# EAGLE design decoder (EAGLE 7.2.0)
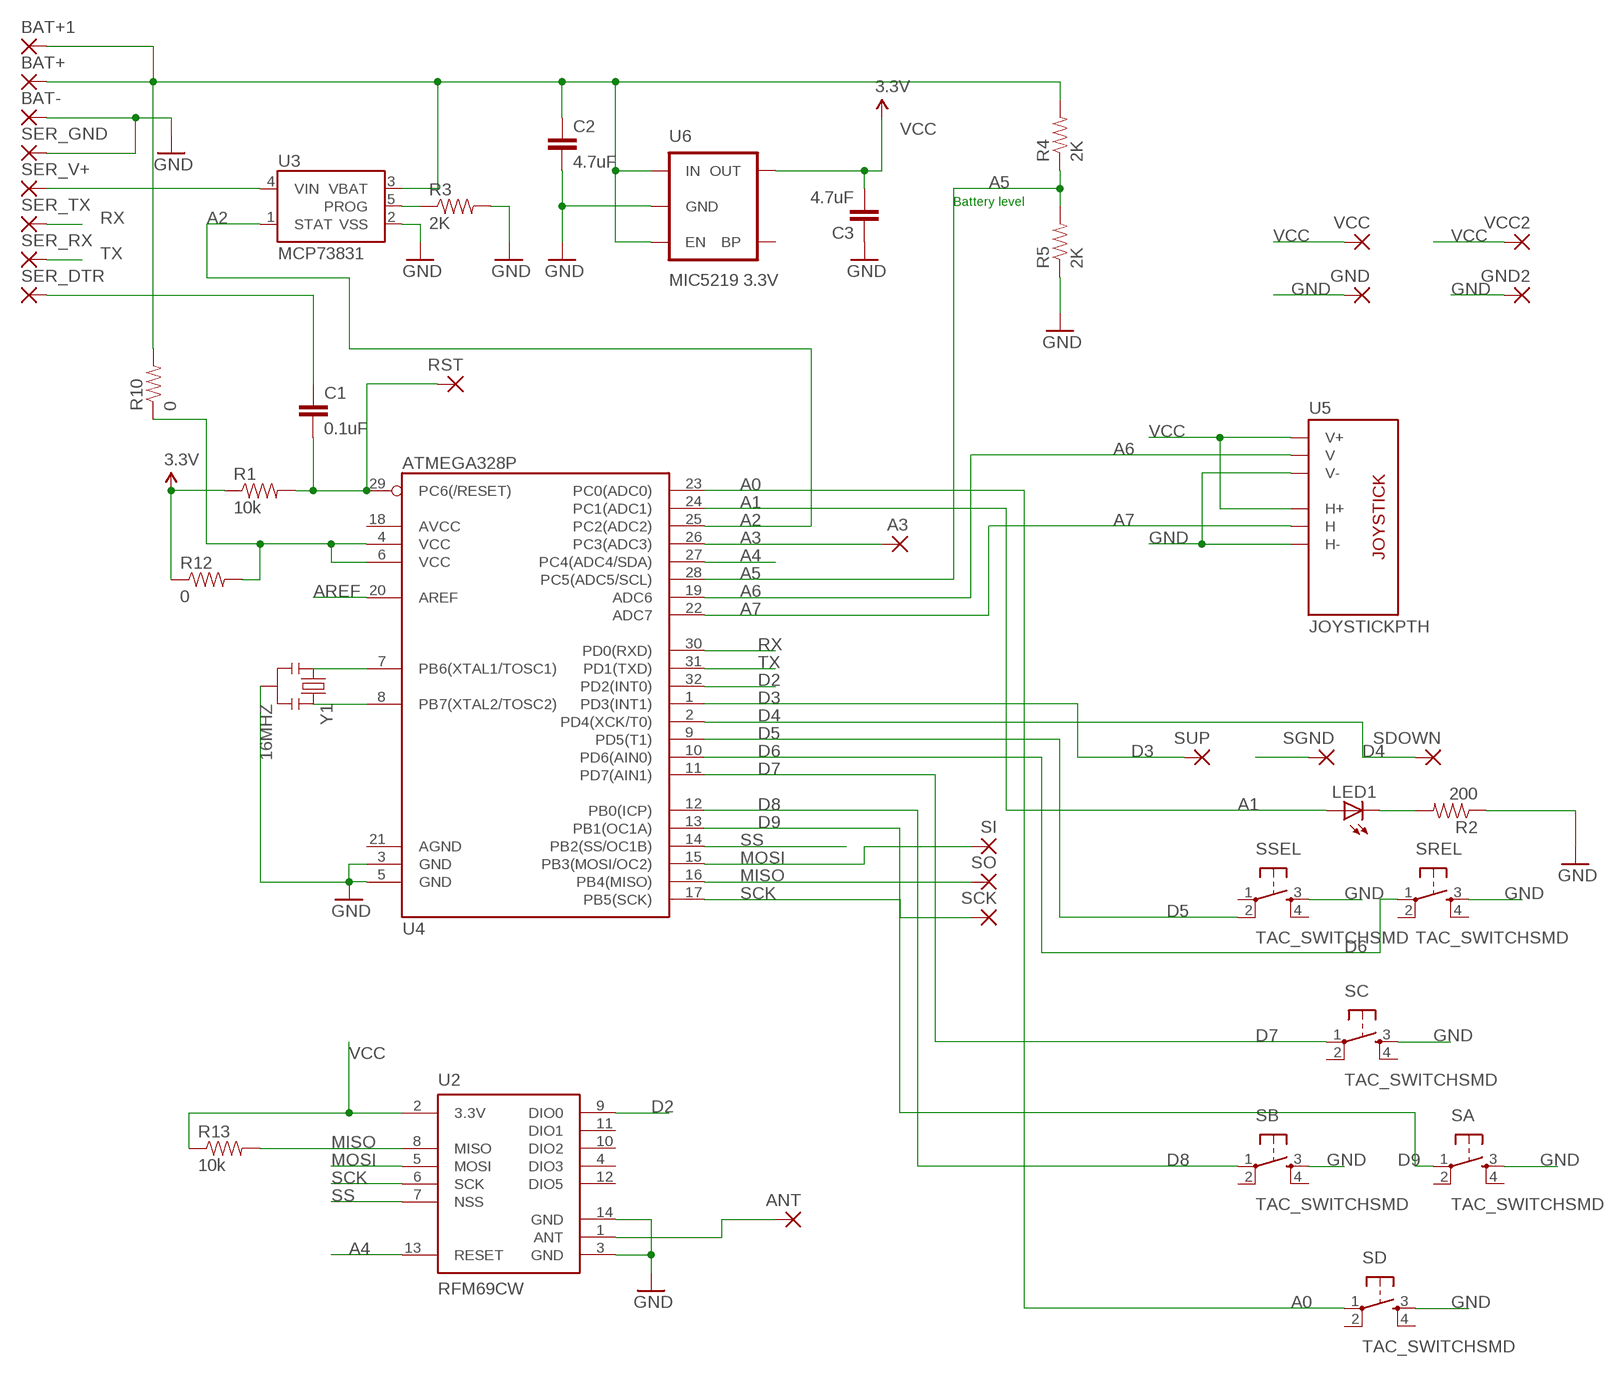
[diagram p0: schematic, sheet 1]

## Parts
A3  SMD2  [SMD1,27-2,54]
ANT  SMD2  [SMD1,27-2,54]
BAT+  SMD2  [SMD1,27-2,54]
BAT+1  SMD2  [SMD1,27-2,54]
BAT-  SMD2  [SMD1,27-2,54]
C1  0.1uF  CAP0805  [0805]
C2  4.7uF  CAP0805  [0805]
C3  4.7uF  CAP0805  [0805]
GND  SMD2  [SMD1,27-2,54]
GND2  SMD2  [SMD1,27-2,54]
LED1  LED3MM  [LED3MM]
R1  10k  RESISTOR0603-RES  [0603-RES]
R2  200  RESISTOR0603-RES  [0603-RES]
R3  2K  RESISTOR0603-RES  [0603-RES]
R4  2K  RESISTOR0603-RES  [0603-RES]
R5  2K  RESISTOR0603-RES  [0603-RES]
R10  0  RESISTOR0603-RES  [0603-RES]
R12  0  RESISTOR0603-RES  [0603-RES]
R13  10k  RESISTOR0603-RES  [0603-RES]
RST  SMD2  [SMD1,27-2,54]
SA  TAC_SWITCHSMD  [TACTILE-SWITCH-SMD]
SB  TAC_SWITCHSMD  [TACTILE-SWITCH-SMD]
SC  TAC_SWITCHSMD  [TACTILE-SWITCH-SMD]
SCK  SMD2  [SMD1,27-2,54]
SD  TAC_SWITCHSMD  [TACTILE-SWITCH-SMD]
SDOWN  SMD2  [SMD1,27-2,54]
SER_DTR  SMD2  [SMD1,27-2,54]
SER_GND  SMD2  [SMD1,27-2,54]
SER_RX  SMD2  [SMD1,27-2,54]
SER_TX  SMD2  [SMD1,27-2,54]
SER_V+  SMD2  [SMD1,27-2,54]
SGND  SMD2  [SMD1,27-2,54]
SI  SMD2  [SMD1,27-2,54]
SO  SMD2  [SMD1,27-2,54]
SREL  TAC_SWITCHSMD  [TACTILE-SWITCH-SMD]
SSEL  TAC_SWITCHSMD  [TACTILE-SWITCH-SMD]
SUP  SMD2  [SMD1,27-2,54]
U2  RFM69CW  [RFM69CW-XXXS2]
U3  MCP73831  [SOT23-5]
U4  ATMEGA328P  ATMEGA328_SMT  [TQFP32-08]
U5  JOYSTICKPTH  [JOYSTICK]
U6  MIC5219 3.3V  V_REG_MIC52193.3V  [SOT23-5]
VCC  SMD2  [SMD1,27-2,54]
VCC2  SMD2  [SMD1,27-2,54]
Y1  16MHZ  RESONATOR16MHZ  [RESONATOR-SMD]

## Nets
A0: SD.1 U4.23(PC0(ADC0))
A1: LED1.A U4.24(PC1(ADC1))
A2: U3.1(STAT) U4.25(PC2(ADC2))
A3: A3.1(P) U4.26(PC3(ADC3))
A4: U2.13(RESET) U4.27(PC4(ADC4/SDA))
A5: R4.1 R5.2 U4.28(PC5(ADC5/SCL))
A6: U4.19(ADC6) U5.V2(V)
A7: U4.22(ADC7) U5.H2(H)
AREF: U4.20(AREF)
BAT+: BAT+1.1(P) BAT+.1(P) C2.1 R4.2 R10.2 U3.3(VBAT) U6.1(IN) U6.3(EN)
D2: U2.9(DIO0) U4.32(PD2(INT0))
D3: SUP.1(P) U4.1(PD3(INT1))
D4: SDOWN.1(P) U4.2(PD4(XCK/T0))
D5: SSEL.2 U4.9(PD5(T1))
D6: SREL.1 U4.10(PD6(AIN0))
D7: SC.1 U4.11(PD7(AIN1))
D8: SB.1 U4.12(PB0(ICP))
D9: SA.1 U4.13(PB1(OC1A))
GND: BAT-.1(P) C2.2 C3.1 GND2.1(P) GND.1(P) R2.1 R3.2 R5.1 SA.3 SB.3 SC.3 SD.3 SER_GND.1(P) SGND.1(P) SREL.3 SSEL.3 U2.3(GND) U2.14(GND) U3.2(VSS) U4.3(GND) U4.5(GND) U5.H3(H-) U5.V3(V-) U6.2(GND) Y1.2
MISO: R13.2 SO.1(P) U2.8(MISO) U4.16(PB4(MISO))
MOSI: SI.1(P) U2.5(MOSI) U4.15(PB3(MOSI/OC2))
N$1: ANT.1(P) U2.1(ANT)
N$2: U4.7(PB6(XTAL1/TOSC1)) Y1.1
N$3: C1.1 SER_DTR.1(P)
N$4: U4.8(PB7(XTAL2/TOSC2)) Y1.3
N$5: C1.2 R1.2 RST.1(P) U4.29(PC6(/RESET))
N$8: R10.1 R12.2 U4.4(VCC) U4.6(VCC)
N$9: SER_V+.1(P) U3.4(VIN)
N$11: R3.1 U3.5(PROG)
N$17: LED1.K(C) R2.2
RX: SER_TX.1(P) U4.30(PD0(RXD))
SCK: SCK.1(P) U2.6(SCK) U4.17(PB5(SCK))
SS: U2.7(NSS) U4.14(PB2(SS/OC1B))
TX: SER_RX.1(P) U4.31(PD1(TXD))
VCC: C3.2 R1.1 R12.1 R13.1 U2.2(3.3V) U5.H1(H+) U5.V1(V+) U6.5(OUT) VCC2.1(P) VCC.1(P) ; supply symbol labelled 3.3V
Unconnected: SA.2 SA.4 SB.2 SB.4 SC.2 SC.4 SD.2 SD.4 SREL.2 SREL.4 SSEL.1 SSEL.4 U2.4(DIO3) U2.10(DIO2) U2.11(DIO1) U2.12(DIO5) U4.18(AVCC) U4.21(AGND) U6.4(BP)

## Notes on the sheet
- Battery level

## Library data of the parts
A3 ANT BAT+ BAT+1 BAT- GND GND2 RST SCK SDOWN SER_DTR SER_GND SER_RX SER_TX SER_V+ SGND SI SO SUP VCC VCC2 = wirepad:SMD2: SMD PAD
C1-C3 = SparkFun-Capacitors:CAP: Capacitor Standard 0603 ceramic capacitor, and 0.1" leaded capacitor.
LED1 = led:LED: LED OSRAM: - CHIPLED LG R971, LG N971, LY N971, LG Q971, LY Q971, LO R971, LY R971 LH N974, LH R974 LS Q976, LO Q976, LY Q976 LO Q996 - Hyper CHIPLED LW Q18S LB Q993, LB Q99A, LB R99A - SideLED LS A670, LO A670, LY A670, LG A670, LP A670 LB A673, LV A673, LT A673, LW A673 LH A674 LY A675 LS A676, LA A676, LO A676, LY A676, LW A676 LS A679, LY A679, LG A679 - Hyper Micro SIDELED® LS Y876, LA Y876, LO Y876, LY Y876 LT Y87S - SmartLED LW L88C, LW L88S LB L89C, LB L89S, LG L890 LS L89K, LO L89K, LY L89K LS L896, LA L896, LO L896, LY L896 - TOPLED LS T670, LO T670, LY T670, LG T670, LP T670 LSG T670, LSP T670, LSY T670, LOP T670, LYG T670 LG T671, LOG T671, LSG T671 LB T673, LV T673, LT T673, LW T673 LH T674 LS T676, LA T676, LO T676, LY T676, LB T676, LH T676, LSB T676, LW T676 LB T67C, LV T67C, LT T67C, LS T67K, LO T67K, LY T67K, LW E67C LS E67B, LA E67B, LO E67B, LY E67B, LB E67C, LV E67C, LT E67C LW T67C LS T679, LY T679, LG T679 LS T770, LO T770, LY T770, LG T770, LP T770 LB T773, LV T773, LT T773, LW T773 LH T774 LS E675, LA E675, LY E675, LS T675 LS T776, LA T776, LO T776, LY T776, LB T776 LHGB T686 LT T68C, LB T68C - Hyper Mini TOPLED® LB M676 - Mini TOPLED Santana® LG M470 LS M47K, LO M47K, LY M47K Source: http://www.osram.convergy.de LUXEON: - LUMILED® LXK2-PW12-R00, LXK2-PW12-S00, LXK2-PW14-U00, LXK2-PW14-V00 LXK2-PM12-R00, LXK2-PM12-S00, LXK2-PM14-U00 LXK2-PE12-Q00, LXK2-PE12-R00, LXK2-PE12-S00, LXK2-PE14-T00, LXK2-PE14-U00 LXK2-PB12-K00, LXK2-PB12-L00, LXK2-PB12-M00, LXK2-PB14-N00, LXK2-PB14-P00, LXK2-PB14-Q00 LXK2-PR12-L00, LXK2-PR12-M00, LXK2-PR14-Q00, LXK2-PR14-R00 LXK2-PD12-Q00, LXK2-PD12-R00, LXK2-PD12-S00 LXK2-PH12-R00, LXK2-PH12-S00 LXK2-PL12-P00, LXK2-PL12-Q00, LXK2-PL12-R00 Source: www.luxeon.com KINGBRIGHT: KA-3528ASYC Source: www.kingbright.com
R1-R5 R10 R12 R13 = SparkFun-Resistors:RESISTOR: Resistor Basic schematic elements and footprints for 0603, 1206, and PTH resistors.
SA SB SC SD SREL SSEL = SparkFun-Retired:TAC_SWITCH: Momentary Switch Button commonly used for reset or general input. Spark Fun Electronics SKU : COM-00097 SMT- SWCH-08247; PROD_ID: SWCH-08247
U2 = SparkFun-RF:RFM69
U3 = SparkFun-PowerIC:MCP73831: Miniature single cell, fully integrated Li-Ion, Li-polymer charge management controller http://ww1.microchip.com/downloads/en/DeviceDoc/21984a.pdf IC-09995; PROD_ID: IC-09995
U4 = SparkFun-DigitalIC:ATMEGA328_SMT: 32-Pin Atmega328 part Commonly used on Arduino compatible boards Available in QFP and QFN packages TQFP is IC-09069 QFN is non-stock; PROD_ID: IC-09069
U5 = Arduino_merg:JOYSTICK: Thumb Joystick Joystick commonly found in PS2 controllers. Two pots and a select switch. Adapted from Sparkfun Library (but for more common 6mm switch sticks)
U6 = SparkFun-PowerIC:V_REG_MIC5219: V_REG MIC5219 Standard 3.3V and 5V 500mA LDO voltage regulator in SOT-23 layout. Micrel part MIC5219. BP (by-pass) pin is used to lower output noise with 470pF cap, may be left open.; PROD_ID: VREG-09872
Y1 = SparkFun-FreqCtrl:RESONATOR: Resonator Small SMD resonator. Used, eg, on the Arduino Pro/ Pro Mini boards. 8MHz- XTAL-08895 16MHz- XTAL-08900; PROD_ID: XTAL-08900

## Board
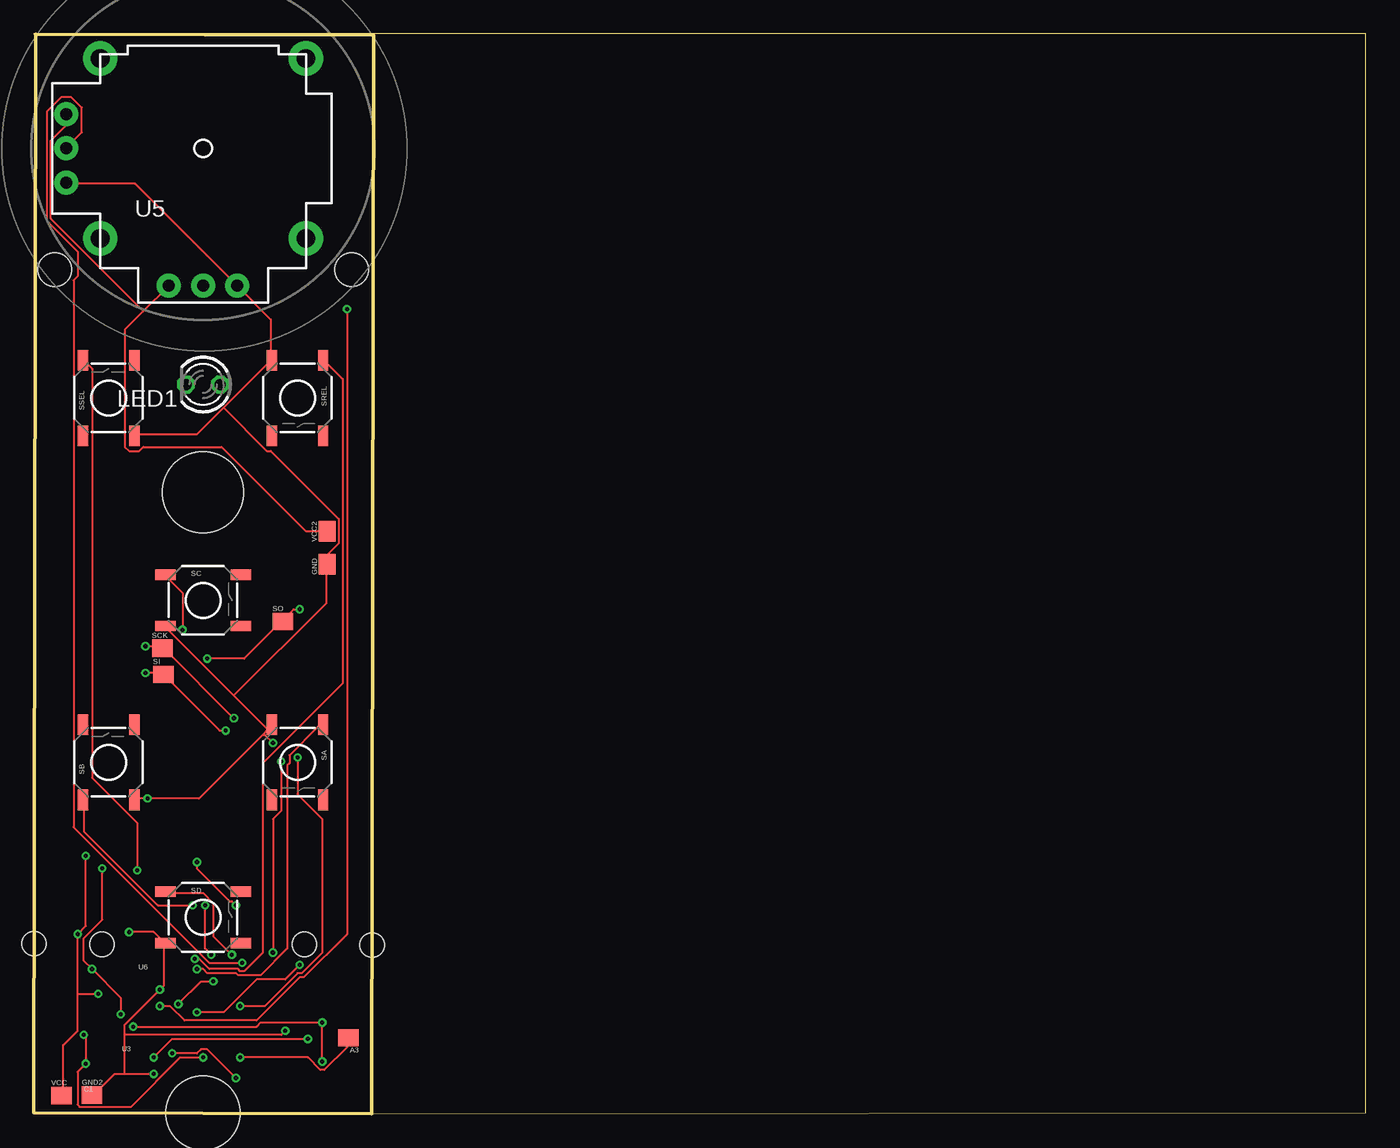
[diagram p1: board, top side]
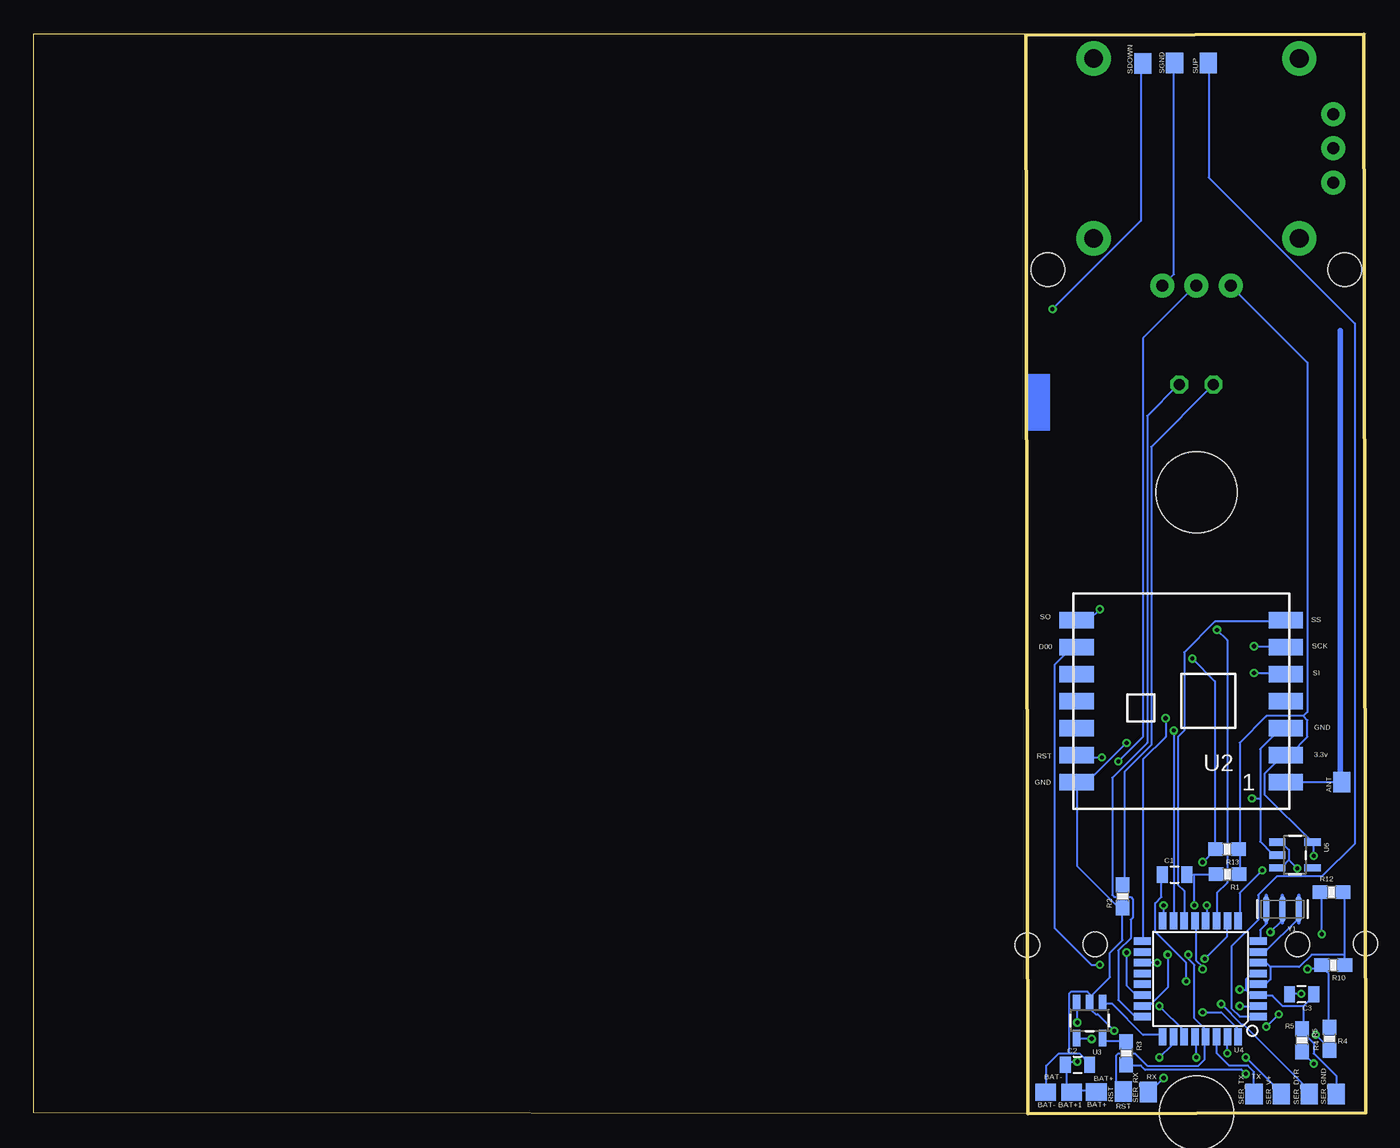
[diagram p2: board, bottom side, seen from below]

Size 98.73 x 80.06 mm. Coordinates in mm from the lower left corner, seen from the top.
Outline: 25.05,0 98.73,0.06 98.73,80.06 0,80.06 0.15,80.01
Outline: 0.15,80.01 25.2,79.95 25.05,0
Outline: 25.05,0 0,0.06 0.15,80.01
Copper layers (1*16): Top 0.035mm / dielectric 1.5mm / Bottom 0.035mm
Design rules "Elecrow_2-layer_eagle_rule": minimum track width 6mil, minimum drill 12mil, track to track 6mil, track to pad 6mil, pad to pad 6mil, via to via 6mil, smd to smd 0mil, copper to edge 10mil, drill to drill 10mil, minimum pad ring 10mil, minimum via ring 6mil, stop-mask expansion 2mil, vias tented up to drill 100mil, thermal gap 10mil
Holes 1.8 mm at 20.05,12.56 5.05,12.56 25.08,12.51 0.03,12.61
Holes 6 mm at 12.55,46.06
Holes 2.5 mm at 23.55,62.56 1.55,62.56
Holes 5.5 mm at 12.55,0.06

### Footprints (pad centres in the part's own frame; a part is rotated, then mirrored left to right if it is on the bottom)
SMD1,27-2,54 = smd 1.27 x 1.524: 1 0,0
0805 = smd 0.8 x 1.2: 1 -0.9,0; 2 0.9,0
LED3MM = drill 0.813 octagon: A -1.27,0; K 1.27,0
0603-RES = smd 1.1 x 1: 1 -0.85,0; 2 0.85,0
TACTILE-SWITCH-SMD = smd 1.524 x 0.762: 1 -2.794,1.905; 2 2.794,1.905; 3 -2.794,-1.905; 4 2.794,-1.905
RFM69CW-XXXS2 = smd 2.543 x 1.2: 1 -7.754,6; 2 -7.754,4; 3 -7.754,2; 4 -7.754,0; 5 -7.754,-2; 6 -7.754,-4; 7 -7.754,-6; 8 7.754,-6; 9 7.754,-4; 10 7.754,-2; 11 7.754,0; 12 7.754,2; 13 7.754,4; 14 7.754,6
SOT23-5 = smd 0.55 x 1.2: 1 -0.95,-1.3; 2 0,-1.3; 3 0.95,-1.3; 4 0.95,1.3; 5 -0.95,1.3
TQFP32-08 = smd 1.27 x 0.559: 1 -4.293,2.8; 2 -4.293,2; 3 -4.293,1.2; 4 -4.293,0.4; 5 -4.293,-0.4; 6 -4.293,-1.2; 7 -4.293,-2; 8 -4.293,-2.8; 17 4.293,-2.8; 18 4.293,-2; 19 4.293,-1.2; 20 4.293,-0.4; 21 4.293,0.4; 22 4.293,1.2; 23 4.293,2; 24 4.293,2.8 | smd 0.559 x 1.27: 9 -2.8,-4.293; 10 -2,-4.293; 11 -1.2,-4.293; 12 -0.4,-4.293; 13 0.4,-4.293; 14 1.2,-4.293; 15 2,-4.293; 16 2.8,-4.293; 25 2.8,4.293; 26 2,4.293; 27 1.2,4.293; 28 0.4,4.293; 29 -0.4,4.293; 30 -1.2,4.293; 31 -2,4.293; 32 -2.8,4.293
JOYSTICK = drill 0.889 pad 1.778: H1 -2.54,-10.16; H2 0,-10.16; H3 2.54,-10.16; V1 -10.16,2.54; V2 -10.16,0; V3 -10.16,-2.54 | drill 1.397 pad 2.54: MOUNT1 -7.62,6.668; MOUNT2 -7.62,-6.668; MOUNT3 7.62,-6.668; MOUNT4 7.62,6.668
RESONATOR-SMD = smd 0.45 x 1.905: 1 -1.2,0; 2 0,0; 3 1.2,0

### Placement (x,y rotation side)
A3  23.33,5.65 90 top
ANT  1.79,24.6 0 bottom
BAT+  19.97,1.61 90 bottom
BAT+1  21.81,1.59 90 bottom
BAT-  23.74,1.58 90 bottom
C1  14.17,17.73 0 bottom
C2  21.37,3.63 0 bottom
C3  4.75,8.85 180 bottom
GND  21.76,40.73 0 top
GND2  4.33,1.39 270 top
LED1  12.55,54.06 180 top
R1  10.24,17.75 180 bottom
R2  18.03,16.12 90 bottom
R3  17.75,4.49 270 bottom
R4  2.69,5.57 90 bottom
R5  4.72,5.45 270 bottom
R10  2.41,11.03 180 bottom
R12  2.54,16.43 0 bottom
R13  10.28,19.61 180 bottom
RST  17.96,1.64 0 bottom
SA  19.55,26.06 270 top
SB  5.55,26.06 90 top
SC  12.55,38.06 0 top
SCK  9.53,34.51 270 top
SD  12.55,14.56 0 top
SDOWN  16.53,77.87 0 bottom
SER_DTR  4.2,1.45 0 bottom
SER_GND  2.18,1.48 0 bottom
SER_RX  16.12,1.6 0 bottom
SER_TX  8.28,1.48 0 bottom
SER_V+  6.25,1.47 0 bottom
SGND  14.17,77.89 0 bottom
SI  9.61,32.58 270 top
SO  18.47,36.5 270 top
SREL  19.55,53.06 270 top
SSEL  5.55,53.06 90 top
SUP  11.68,77.88 0 bottom
U2  13.69,30.59 180 bottom
U3  20.47,6.92 180 bottom
U4  12.26,10 180 bottom
U5  12.55,71.56 0 top
U6  5.25,19.18 270 bottom
VCC  2.06,1.36 270 top
VCC2  21.74,43.17 0 top
Y1  6.18,15.17 180 bottom

### Tracks (layer width: path | path; a pad name or v marks a point on that pad's centre or on a via)
A0  (via drill 0.3)
  Top 0.152: v14.68,11.8 13.31,13.17 13.31,15.61 12.55,16.37 9.81,16.37 SD.1
  Bottom 0.152: v14.68,11.8 14.68,9.36 15.9,8.14 16.51,8.14 U4.23
A1
  Bottom 0.152: U4.24 16.66,7.22 17.12,7.22 18.34,8.44 18.34,12.1 17.43,13.01 17.43,14.39 17.27,14.54 17.27,15.91 17.43,16.06 18.65,16.06 18.8,16.21 18.8,24.9 16.21,27.49 16.21,51.72 13.92,54.01 LED1.A
A2
  Bottom 0.152: U3.1 19.41,8.14 18.8,8.14 16.51,5.85 15.14,5.85 U4.25
A3  (via drill 0.3)
  Top 0.152: v15.29,4.18 20.32,4.18 21.24,3.26 21.54,3.26 23.22,4.94 23.22,5.55 A3.1
  Bottom 0.152: v15.29,4.18 14.38,5.09 14.38,5.7 U4.26
A4  (via drill 0.3)
  Top 0.152: v15.29,7.99 17.12,7.99 19.56,10.42 19.86,10.42 21.39,11.95 21.39,21.85 19.56,23.68 v19.56,26.43
  Bottom 0.152: v15.29,7.99 13.46,6.16 13.46,5.85 U4.27 | v19.56,26.43 21.24,26.43 21.39,26.58 U2.13
A5  (via drill 0.3)
  Top 0.152: v3.71,5.85 3.86,5.7 v3.86,3.72 3.25,3.11 3.25,0.67 3.41,0.52 7.22,0.52 10.87,4.18 v12.55,4.18
  Bottom 0.152: v3.86,3.72 4.62,4.48 R5.2 | v3.71,5.85 2.64,4.78 R4.1 | v12.55,4.18 12.55,5.7 U4.28
A6  (via drill 0.3)
  Top 0.152: v15.44,11.19 13.01,11.19 2.95,21.24 2.95,61.78 3.25,62.09 3.25,63.92 0.97,66.2 0.97,74.28 2.03,75.35 2.8,75.35 3.56,74.58 3.56,72.76 2.49,71.69 U5.V2
  Bottom 0.152: v15.44,11.19 16.51,11.19 U4.19
A7  (via drill 0.3)
  Top 0.152: v17.73,11.95 17.73,21.85 18.34,22.46 v18.34,26.12
  Bottom 0.152: v17.73,11.95 17.73,9.51 17.12,8.9 16.66,8.9 U4.22 | v18.34,26.12 16.51,27.95 16.51,57.52 12.7,61.33 U5.H2
BAT+  (via drill 0.3)
  Top 0.152: v21.39,3.87 v21.39,6.77 16.82,6.77 16.51,6.46 v7.37,6.46 | v5.08,18.2 5.08,14.39 3.71,13.01 3.71,11.34 v4.32,10.73 6.45,8.59 v6.45,7.38
  Bottom 0.152: v21.39,6.77 21.39,8.14 U3.3 | v21.39,3.87 22,3.87 22.15,3.72 C2.1 22.15,3.57 22.15,2.04 21.85,1.74 BAT+1.1 21.69,1.74 20.02,1.74 BAT+.1 | 5.69,18.81 6.15,18.35 6.45,18.35 U6.3 | 5.69,18.81 5.69,19.57 6.15,20.02 6.45,20.02 U6.1 | R4.2 2.8,6.46 2.8,10.42 3.25,10.88 R10.2 3.41,10.88 3.56,10.73 v4.32,10.73 | v5.08,18.2 5.69,18.81 | v6.45,7.38 v7.37,6.46
D2  (via drill 0.3)
  Top 0.152: v12.09,7.53 14.07,7.53 16.51,9.97 18.65,9.97 v19.71,11.03
  Bottom 0.152: v12.09,7.53 10.72,7.53 9.5,6.31 9.5,5.85 U4.32 | v19.71,11.03 20.32,11.03 23.06,13.78 23.06,33.28 21.85,34.5 21.54,34.5 U2.9
D3
  Bottom 0.152: U4.1 7.98,7.22 9.35,7.22 9.96,7.83 9.96,12.4 7.98,14.39 7.98,16.21 6.61,17.59 3.25,17.59 0.81,20.02 0.81,58.58 11.63,69.4 11.63,77.78 SUP.1
D4  (via drill 0.3)
  Top 0.152: v9.35,7.99 10.11,7.99 11.18,6.92 16.51,6.92 19.71,10.12 20.02,10.12 23.22,13.32 v23.22,59.65
  Bottom 0.152: v9.35,7.99 7.98,7.99 U4.2 | v23.22,59.65 16.66,66.2 16.66,77.78 SDOWN.1
D5  (via drill 0.3)
  Top 0.152: v7.67,18.04 7.67,21.55 4.32,24.9 4.32,55.23 3.71,55.84 SSEL.2
  Bottom 0.152: v7.67,18.04 9.35,16.37 9.35,14.39 U4.9
D6  (via drill 0.3)
  Top 0.152: v11.94,11.49 12.24,11.49 13.01,10.73 15.14,10.73 15.29,10.58 15.6,10.58 16.97,11.95 16.97,25.97 22.91,31.91 22.91,54.47 21.54,55.84 SREL.1
  Bottom 0.152: v11.94,11.49 10.26,13.17 10.26,14.23 U4.10
D7  (via drill 0.3)
  Top 0.152: v11.03,35.87 11.03,38.62 9.81,39.84 SC.1
  Bottom 0.152: v11.03,35.87 10.26,35.11 10.26,17.13 11.03,16.37 11.03,14.39 U4.11
D8  (via drill 0.3)
  Top 0.152: v11.79,15.45 9.2,15.45 3.71,20.94 3.71,23.23 SB.1
  Bottom 0.152: v11.79,15.45 11.79,14.39 U4.12
D9  (via drill 0.3)
  Top 0.152: v12.09,10.73 12.55,10.73 12.85,10.42 14.99,10.42 15.14,10.27 16.82,10.27 18.8,12.25 18.8,25.82 18.95,25.97 18.95,26.58 21.08,28.71 21.39,28.71 SA.1
  Bottom 0.152: v12.09,10.73 12.09,10.88 12.55,11.34 12.55,14.23 U4.13
GND  (via drill 0.3)
  Top 0.152: 6.76,2.96 6,2.96 4.47,1.43 GND2.1 | 6.76,2.96 v8.89,2.96 | 6.76,2.96 6.76,5.85 | 6.76,5.85 6.76,6.61 v9.35,9.2 9.65,9.51 9.65,12.56 SD.3 9.65,12.71 8.89,13.47 v7.06,13.47 | 6.76,5.85 18.34,5.85 v18.65,6.16 | 17.43,28.56 17.58,28.71 SA.3 17.43,28.56 | 17.43,28.56 16.97,28.1 | 16.97,28.1 12.24,23.38 v8.43,23.38 7.52,23.38 SB.3 | 14.84,31 17.27,28.56 17.43,28.56 | 14.84,31 9.81,36.03 SC.3 | 14.84,31 21.69,37.86 21.69,40.6 GND.1 21.85,40.75 21.85,41.51 22.61,42.28 22.61,44.1 17.58,49.13 17.27,49.13 14.07,52.33 | 14.07,52.33 17.58,55.84 SREL.3 17.58,55.99 17.58,58.89 15.14,61.33 U5.H3 14.99,61.48 7.52,68.95 2.49,68.95 U5.V3 | 14.07,52.33 12.09,50.35 7.52,50.35 SSEL.3 | v17.73,27.49 17.12,28.1 16.97,28.1
  Bottom 0.152: 8.89,9.2 8.59,8.9 7.98,8.9 U4.3 7.82,8.75 6.91,8.75 6.15,7.99 4.62,7.99 | 8.89,9.2 8.89,9.97 8.59,10.27 7.98,10.27 U4.5 | 4.62,7.99 4.62,6.31 R5.1 4.78,6.16 3.86,5.24 3.86,4.48 2.19,2.8 2.19,1.58 SER_GND.1 | 4.62,7.99 3.86,8.75 C3.1 | v8.89,2.96 9.2,3.26 16.36,3.26 16.66,3.57 17.73,3.57 R3.2 | v7.06,13.47 6.3,14.23 6.18,14.15 | v9.35,9.2 8.89,9.2 | 22,4.48 22.76,4.48 23.67,3.57 23.67,1.58 BAT-.1 | 22,4.48 21.24,4.48 20.47,3.72 C2.2 | 18.04,15 18.04,12.86 18.95,11.95 18.95,10.12 20.32,8.75 | 18.04,15 18.04,15.15 R2.1 18.04,15 | 20.32,8.75 20.32,8.29 U3.2 | 18.04,15 21.39,18.35 21.39,24.44 U2.14 21.39,24.6 20.63,24.6 v17.73,27.49 | 22,4.48 22,8.9 21.85,9.05 20.63,9.05 20.32,8.75 | 20.32,8.75 U3.2 | v18.65,6.16 19.86,7.38 20.02,7.38 20.32,7.68 20.32,8.14 U3.2 | 7.82,23.38 7.82,27.04 6.3,28.56 6,28.56 U2.3 | 7.82,23.38 7.82,20.18 6.91,19.26 6.61,19.26 U6.2 | v8.43,23.38 7.82,23.38 | SGND.1 14.23,77.78 14.23,62.24 14.99,61.48 U5.H3
MISO  (via drill 0.3)
  Top 0.152: v12.85,33.74 15.6,33.74 18.34,36.48 SO.1 18.49,36.64 19.25,37.4 v19.71,37.4 | v14.99,15.45 14.68,15.76 14.53,15.76 12.09,18.2 v12.09,18.65
  Bottom 0.152: v12.85,33.74 11.18,32.06 11.18,19.72 R13.2 11.18,19.57 v12.09,18.65 | v14.99,15.45 14.99,14.39 U4.16 | v19.71,37.4 20.47,36.64 21.39,36.64 U2.8
MOSI  (via drill 0.3)
  Top 0.152: v14.23,28.41 13.77,28.41 9.65,32.52 SI.1 9.5,32.67 v8.28,32.67
  Bottom 0.152: v14.23,28.41 14.23,14.39 U4.15 | v8.28,32.67 6,32.67 U2.5
N$1
  Bottom 0.152: ANT.1 1.88,24.6 5.84,24.6 U2.1
N$2
  Bottom 0.152: U4.7 7.82,12.1 7.37,12.1 5.08,14.39 Y1.1
N$3  (via drill 0.3)
  Top 0.152: v13.31,9.81 12.4,9.81 v10.72,8.14
  Bottom 0.152: v13.31,9.81 13.31,11.19 15.6,13.47 15.6,15.61 15.14,16.06 15.14,17.59 C1.1 | v10.72,8.14 9.2,6.61 9.04,6.61 4.32,1.89 4.32,1.58 SER_DTR.1
N$4
  Bottom 0.152: U4.8 7.82,12.86 7.82,13.62 7.37,14.08 7.38,14.15
N$5  (via drill 0.3)
  Top 0.152: v12.7,15.45 12.7,12.25 v13.16,11.8
  Bottom 0.152: 12.7,17.74 13.16,17.74 C1.2 | 12.7,17.74 11.18,17.74 R1.2 | RST.1 18.04,1.74 18.49,2.19 18.49,4.33 18.34,4.48 17.12,4.48 16.21,3.57 12.4,3.57 11.94,4.02 11.94,5.7 U4.29 11.94,5.85 11.94,6.31 12.7,7.07 12.7,11.03 13.16,11.49 v13.16,11.8 | v12.7,15.45 12.7,17.74
N$6
  Bottom 0.406: 1.89,24.63 1.89,58.05
N$8
  Bottom 0.152: 7.06,10.88 7.06,9.97 7.37,9.66 7.82,9.66 U4.4 | 7.06,10.88 7.37,11.19 7.82,11.19 U4.6 | 1.58,11.8 1.58,16.37 R12.2 | 1.58,11.8 1.58,11.03 R10.1 | 7.06,10.88 4.93,10.88 4.01,11.8 1.58,11.8
N$9  (via drill 0.3)
  Top 0.152: v20.32,5.55 10.26,5.55 v8.89,4.18
  Bottom 0.152: v20.32,5.55 21.39,5.55 U3.4 | v8.89,4.18 6.3,1.58 SER_V+.1
N$11
  Bottom 0.152: R3.1 17.88,5.39 19.25,5.39 19.41,5.55 U3.5
N$17
  Bottom 0.152: R2.2 17.88,16.98 17.88,25.36 15.9,27.34 15.9,49.44 11.33,54.01 LED1.K
RX
  Bottom 0.152: U4.30 11.03,5.7 11.03,4.48 10.11,3.57 8.74,3.57 8.28,3.11 8.28,1.58 SER_TX.1
SCK  (via drill 0.3)
  Top 0.152: v14.84,29.32 9.65,34.5 SCK.1 9.5,34.66 v8.28,34.66
  Bottom 0.152: v14.84,29.32 14.84,27.95 16.51,26.27 16.51,12.86 U4.17 | v8.28,34.66 6,34.66 U2.6
SS
  Bottom 0.152: U4.14 13.46,14.39 13.46,16.52 13.92,16.98 13.92,27.95 13.46,28.41 13.46,34.2 11.18,36.48 6,36.48 U2.7
TX  (via drill 0.3)
  Top 0.152: v10.26,4.48 12.09,4.48 12.4,4.78 12.85,4.78 v14.99,2.65
  Bottom 0.152: v10.26,4.48 U4.31 | v14.99,2.65 16.05,1.58 SER_RX.1
VCC  (via drill 0.3)
  Top 0.152: 3.25,8.9 3.25,6.16 2.19,5.09 2.19,1.43 VCC.1 | 3.25,8.9 v3.25,13.32 3.86,13.93 v3.86,19.11 | 3.25,8.9 v4.78,8.9 | 8.13,59.5 9.96,61.33 U5.H1 | 8.13,59.5 6.76,58.12 6.76,49.44 7.06,49.13 7.82,49.13 8.13,49.44 13.92,49.44 20.17,43.19 21.69,43.19 VCC2.1 | 8.13,59.5 1.27,66.35 1.27,72.15 2.34,73.21 2.34,73.97 U5.V1
  Bottom 0.152: R1.1 9.35,17.89 9.35,19.57 R13.1 9.35,19.72 9.35,27.49 7.37,29.47 4.62,29.47 | 4.62,29.47 4.32,29.17 4.32,27.95 5.54,26.73 5.84,26.73 U2.2 6,26.73 7.52,25.21 7.52,23.68 4.01,20.18 U6.5 3.86,20.02 v3.86,19.11 | v3.25,13.32 3.25,16.37 R12.1 | v4.78,8.9 5.54,8.9 C3.2 | 4.62,29.47 4.32,29.78 4.32,55.69 9.96,61.33 U5.H1
(copper drawn outside any net)
  shapes: Bottom area x1

### Text on the board
_tsilk: U6 | U3 | C1
_bsilk: SO | SS | SCK | D00 | SI | GND | 3.3v | RST | GND | R5 | R4 | TX | RX | BAT+ | BAT- | RST